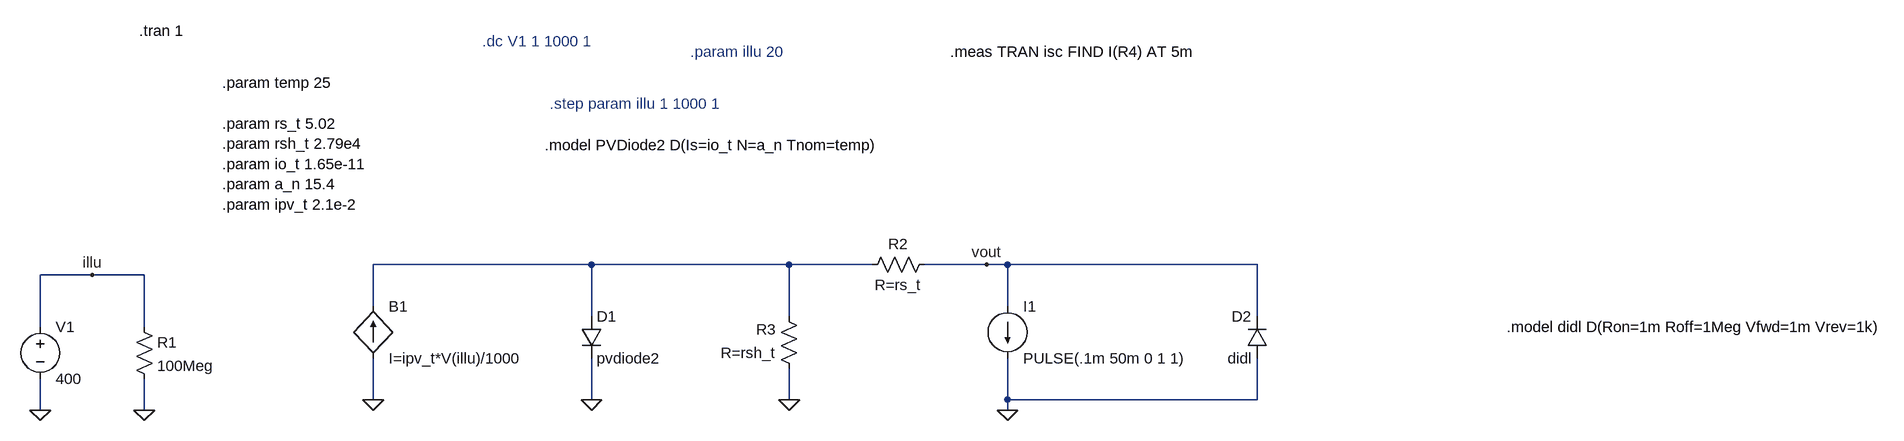
[diagram p0: schematic SM500K12L_Model.asc]
SM500K12L_Model.asc, the LTspice schematic file:
Version 4
SHEET 1 3024 756
WIRE 976 80 640 80
WIRE 1280 80 976 80
WIRE 1408 80 1280 80
WIRE 1584 80 1488 80
WIRE 1616 80 1584 80
WIRE 2000 80 1616 80
WIRE 208 96 128 96
WIRE 288 96 208 96
WIRE 640 144 640 80
WIRE 1616 144 1616 80
WIRE 976 160 976 80
WIRE 1280 160 1280 80
WIRE 2000 160 2000 80
WIRE 128 176 128 96
WIRE 288 176 288 96
WIRE 640 288 640 224
WIRE 976 288 976 224
WIRE 1280 288 1280 240
WIRE 1616 288 1616 224
WIRE 2000 288 2000 224
WIRE 2000 288 1616 288
WIRE 128 304 128 256
WIRE 288 304 288 256
WIRE 1616 304 1616 288
FLAG 128 304 0
FLAG 288 304 0
FLAG 208 96 illu
FLAG 1616 304 0
FLAG 1280 288 0
FLAG 976 288 0
FLAG 640 288 0
FLAG 1584 80 vout
SYMBOL voltage 128 160 R0
WINDOW 123 0 0 Left 0
WINDOW 39 0 0 Left 0
SYMATTR InstName V1
SYMATTR Value 400
SYMBOL res 272 160 R0
SYMATTR InstName R1
SYMATTR Value 100Meg
SYMBOL res 1504 64 R90
WINDOW 0 0 56 VBottom 2
WINDOW 3 32 56 VTop 2
SYMATTR InstName R2
SYMATTR Value R=rs_t
SYMBOL res 1296 256 R180
WINDOW 0 36 76 Left 2
WINDOW 3 36 40 Left 2
SYMATTR InstName R3
SYMATTR Value R=rsh_t
SYMBOL diode 960 160 R0
SYMATTR InstName D1
SYMATTR Value pvdiode2
SYMBOL bi2 640 144 R0
SYMATTR InstName B1
SYMATTR Value I=ipv_t*V(illu)/1000
SYMBOL current 1616 144 R0
WINDOW 123 0 0 Left 0
WINDOW 39 0 0 Left 0
SYMATTR InstName I1
SYMATTR Value PULSE(.1m 50m 0 1 1)
SYMBOL diode 2016 224 R180
WINDOW 0 24 64 Left 2
WINDOW 3 24 0 Left 2
SYMATTR InstName D2
SYMATTR Value didl
TEXT 904 -104 Left 2 !.model PVDiode2 D(Is=io_t N=a_n Tnom=temp)
TEXT 408 -200 Left 2 !.param temp 25\n \n.param rs_t 5.02\n.param rsh_t 2.79e4 \n.param io_t 1.65e-11\n.param a_n 15.4\n.param ipv_t 2.1e-2
TEXT 912 -168 Left 2 ;.step param illu 1 1000 1
TEXT 280 -280 Left 2 !.tran 1
TEXT 1128 -248 Left 2 ;.param illu 20
TEXT 1528 -248 Left 2 !.meas TRAN isc FIND I(R4) AT 5m
TEXT 808 -264 Left 2 ;.dc V1 1 1000 1
TEXT 2384 176 Left 2 !.model didl D(Ron=1m Roff=1Meg Vfwd=1m Vrev=1k)

The netlist it stands for:
* SM500K12L_Model.asc
V1 illu 0 400
R1 illu 0 100Meg
R2 vout N001 R=rs_t
R3 0 N001 R=rsh_t
D1 N001 0 pvdiode2
B1 0 N001 I=ipv_t*V(illu)/1000
I1 vout 0 PULSE(.1m 50m 0 1 1)
D2 0 vout didl
.model D D
.lib standard.dio
.model PVDiode2 D(Is=io_t N=a_n Tnom=temp)
.param temp 25
.param rs_t 5.02
.param rsh_t 2.79e4
.param io_t 1.65e-11
.param a_n 15.4
.param ipv_t 2.1e-2
* .step param illu 1 1000 1
.tran 1
* .param illu 20
.meas TRAN isc FIND I(R4) AT 5m
* .dc V1 1 1000 1
.model didl D(Ron=1m Roff=1Meg Vfwd=1m Vrev=1k)
.backanno
.end